# EAGLE design dht22 (EAGLE 6.5.0)
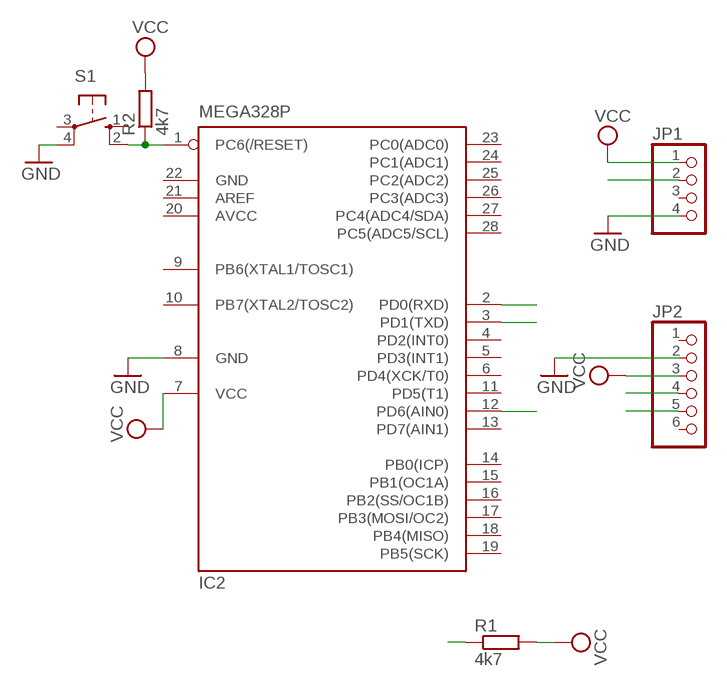
[diagram p0: schematic, sheet 1]

## Parts
IC2  MEGA328P  MEGA8-P  [DIL28-3]
JP1  PINHD-1X4  [1X04]
JP2  PINHD-1X6  [1X06]
R1  4k7  R-EU_0207/10  [0207/10]
R2  4k7  R-EU_0207/10  [0207/10]
S1  10-XX  [B3F-10XX]

## Nets
GND: IC2.8(GND) JP1.4 JP2.2 S1.4(P1)
N$1: IC2.1(PC6(/RESET)) R2.1 S1.2(S1)
PD6: IC2.12(PD6(AIN0)) JP1.2 R1.1
RX: IC2.2(PD0(RXD)) JP2.4
TX: IC2.3(PD1(TXD)) JP2.5
VCC: IC2.7(VCC) JP1.1 JP2.3 R1.2 R2.2
Unconnected: IC2.4(PD2(INT0)) IC2.5(PD3(INT1)) IC2.6(PD4(XCK/T0)) IC2.9(PB6(XTAL1/TOSC1)) IC2.10(PB7(XTAL2/TOSC2)) IC2.11(PD5(T1)) IC2.13(PD7(AIN1)) IC2.14(PB0(ICP)) IC2.15(PB1(OC1A)) IC2.16(PB2(SS/OC1B)) IC2.17(PB3(MOSI/OC2)) IC2.18(PB4(MISO)) IC2.19(PB5(SCK)) IC2.21(AREF) IC2.23(PC0(ADC0)) IC2.24(PC1(ADC1)) IC2.25(PC2(ADC2)) IC2.26(PC3(ADC3)) IC2.27(PC4(ADC4/SDA)) IC2.28(PC5(ADC5/SCL)) JP1.3 JP2.1 JP2.6 S1.1(S) S1.3(P)

## Power pins joined to a net without a drawn wire
AVCC: IC2.20(AVCC)
GND: IC2.22(GND)

## Library data of the parts
IC2 = atmel:MEGA8-P: MICROCONTROLLER 8 Kbytes FLASH, 1 kbytes SRAM, 512 bytes EEPROM, USART, 4-channel 10 bit ADC, 2-channel 8 bit ADC Pin compatible with Atmega48, ATMega88, ATMega168 Source: avr.lbr; OC_FARNELL: unknown; OC_NEWARK: unknown
JP1 = pinhead:PINHD-1X4: PIN HEADER
JP2 = pinhead:PINHD-1X6: PIN HEADER
R1 R2 = rcl:R-EU_: RESISTOR, European symbol
S1 = switch-omron:10-XX: OMRON SWITCH; MPN: B3F-1000; OC_FARNELL: 176432; OC_NEWARK: 36M3542

## Board
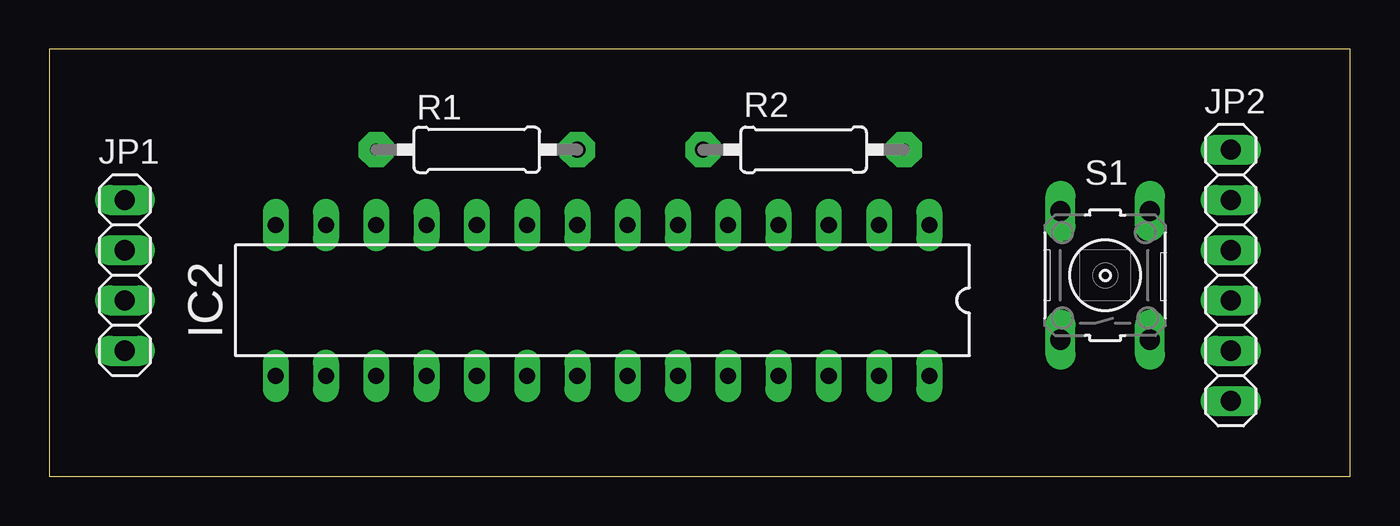
[diagram p1: board, top side]
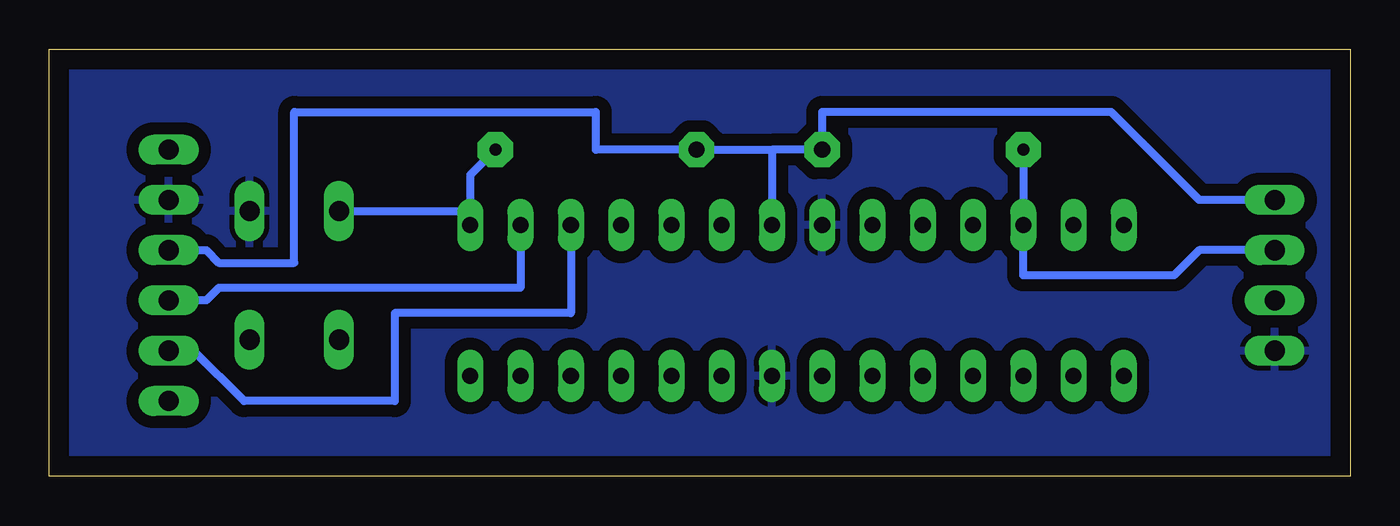
[diagram p2: board, bottom side, seen from below]

Size 65.71 x 21.58 mm. Coordinates in mm from the lower left corner, seen from the top.
Outline: 0,0 65.71,0 65.71,21.58 0,21.58 0,0
Copper layers (1*16): Top 0.035mm / dielectric 1.5mm / Bottom 0.035mm
Design rules "default": minimum track width 10mil, minimum drill 24mil, track to track 8mil, track to pad 8mil, pad to pad 8mil, via to via 8mil, smd to smd 8mil, copper to edge 40mil, drill to drill 8mil, minimum pad ring 10mil, minimum via ring 8mil, stop-mask expansion 4mil, vias tented up to drill 0mil, thermal gap 10mil

### Footprints (pad centres in the part's own frame; a part is rotated, then mirrored left to right if it is on the bottom)
DIL28-3 = drill 0.813 long: 1 -16.51,-3.81; 2 -13.97,-3.81; 3 -11.43,-3.81; 4 -8.89,-3.81; 5 -6.35,-3.81; 6 -3.81,-3.81; 7 -1.27,-3.81; 8 1.27,-3.81; 9 3.81,-3.81; 10 6.35,-3.81; 11 8.89,-3.81; 12 11.43,-3.81; 13 13.97,-3.81; 14 16.51,-3.81; 15 16.51,3.81; 16 13.97,3.81; 17 11.43,3.81; 18 8.89,3.81; 19 6.35,3.81; 20 3.81,3.81; 21 1.27,3.81; 22 -1.27,3.81; 23 -3.81,3.81; 24 -6.35,3.81; 25 -8.89,3.81; 26 -11.43,3.81; 27 -13.97,3.81; 28 -16.51,3.81
1X04 = drill 1.016 long: 1 -3.81,0; 2 -1.27,0; 3 1.27,0; 4 3.81,0
1X06 = drill 1.016 long: 1 -6.35,0; 2 -3.81,0; 3 -1.27,0; 4 1.27,0; 5 3.81,0; 6 6.35,0
0207/10 = drill 0.6 pad 1.778 octagon: 1 -5.08,0 | drill 0.813 pad 1.778 octagon: 2 5.08,0
B3F-10XX = drill 1.016 long: 1 -3.251,2.261; 2 3.251,2.261; 3 -3.251,-2.261; 4 3.251,-2.261

### Placement (x,y rotation side)
IC2  27.94,8.89 180 top
JP1  3.81,10.16 270 top
JP2  59.69,10.16 270 top
R1  21.59,16.51 0 top
R2  38.1,16.51 180 top
S1  53.34,10.16 90 top

### Tracks (layer width: path | path; a pad name or v marks a point on that pad's centre or on a via)
GND
  pour Bottom (isolate 0.61): 0,21.59 66.04,21.59 66.04,0 0,0
N$1
  Bottom 0.406: R2.1 44.45,15.24 44.45,13.34 | 44.45,13.34 IC2.1 | S1.2 44.53,13.41 44.45,13.34
PD6
  Bottom 0.406: JP1.2 7.62,11.43 8.89,10.16 16.51,10.16 IC2.12 R1.1
RX
  Bottom 0.406: IC2.2 41.91,9.53 57.15,9.53 57.78,8.89 JP2.4
TX
  Bottom 0.406: JP2.5 58.42,6.35 55.88,3.81 48.26,3.81 48.26,8.26 39.37,8.26 IC2.3
VCC
  Bottom 0.406: JP1.1 7.62,13.97 12.07,18.41 26.67,18.41 R1.2 29.21,16.51 | 29.21,16.51 IC2.7 | 29.21,16.51 R2.2 38.1,16.51 38.1,18.41 53.34,18.41 53.34,10.79 57.15,10.79 57.78,11.43 JP2.3